# Altium schematic sheet cpu.SchDoc
size A4
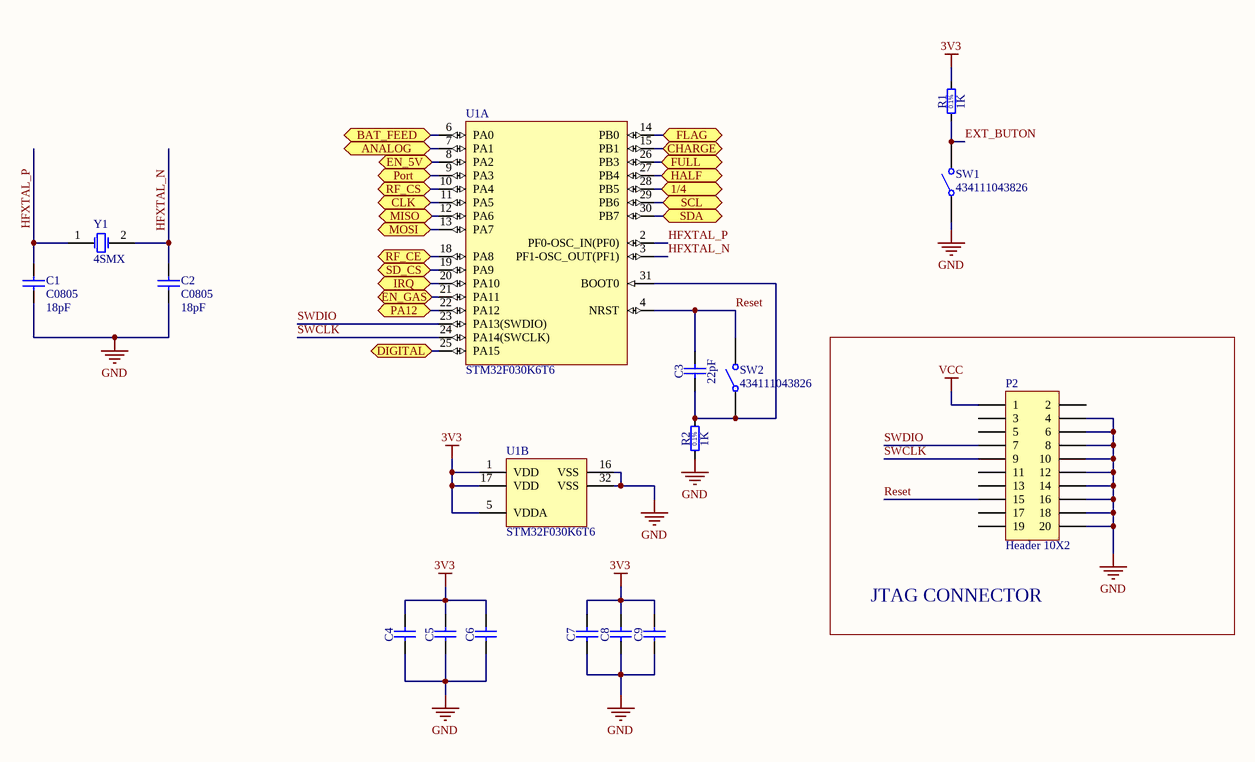
[diagram p0: cpu.SchDoc]

## Parts
C1  C0805  value 18pF  [0805]
C2  C0805  value 18pF  [0805]
C3  22pF  [CAPC2012X135N]
C4  100nF  [CAPC2012X135N]  (value not drawn)
C5  100nF  [CAPC2012X135N]  (value not drawn)
C6  100nF  [CAPC2012X135N]  (value not drawn)
C7  100nF  [CAPC2012X135N]  (value not drawn)
C8  100nF  [CAPC2012X135N]  (value not drawn)
C9  100nF  [CAPC2012X135N]  (value not drawn)
P2  Header 10X2  [HDR2X10]
R1  1K  [RESC2012X60N]
R2  1K  [RESC2012X60N]
SW1  434111043826  [434111043826]
SW2  434111043826  [434111043826]
U1  STM32F030K6T6  [STM-LQFP32_N]  (parts A,B of 2)
Y1  4SMX  [4SMX]

## Blocks framed on the sheet
JTAG CONNECTOR: P2

## Ports
1/4, ANALOG, BAT_FEED, CHARGE, CLK, DIGITAL, EN_5V, EN_GAS, FLAG, FULL, HALF, IRQ, MISO, MOSI, PA12, Port, RF_CE, RF_CS, SCL, SD_CS, SDA

## Nets
3V3: C4.2 C5.2 C6.2 C7.2 C8.2 C9.2 R1.2 U1.1(VDD) U1.5(VDDA) U1.17(VDD)
GND: C1.1 C2.1 C4.1 C5.1 C6.1 C7.1 C8.1 C9.1 P2.4 P2.6 P2.8 P2.10 P2.12 P2.14 P2.16 P2.18 P2.20 R2.1 SW1.1 U1.16(VSS) U1.32(VSS)
VCC: P2.1
1/4: U1.28(PB5) ; port 1/4
ANALOG: U1.7(PA1) ; port ANALOG
BAT_FEED: U1.6(PA0) ; port BAT_FEED
CHARGE: U1.15(PB1) ; port CHARGE
CLK: U1.11(PA5) ; port CLK
DIGITAL: U1.25(PA15) ; port DIGITAL
EN_5V: U1.8(PA2) ; port EN_5V
EN_GAS: U1.21(PA11) ; port EN_GAS
EXT_BUTON: R1.1 SW1.2
FLAG: U1.14(PB0) ; port FLAG
FULL: U1.26(PB3) ; port FULL
HALF: U1.27(PB4) ; port HALF
HFXTAL_N: C2.2 U1.3(PF1-OSC_OUT(PF1)) Y1.2(OSC2)
HFXTAL_P: C1.2 U1.2(PF0-OSC_IN(PF0)) Y1.1(OSC1)
IRQ: U1.20(PA10) ; port IRQ
MISO: U1.12(PA6) ; port MISO
MOSI: U1.13(PA7) ; port MOSI
PA12: U1.22(PA12) ; port PA12
Port: U1.9(PA3) ; port Port
Reset: C3.2 P2.15 SW2.2 U1.4(NRST)
RF_CE: U1.18(PA8) ; port RF_CE
RF_CS: U1.10(PA4) ; port RF_CS
SCL: U1.29(PB6) ; port SCL
SD_CS: U1.19(PA9) ; port SD_CS
SDA: U1.30(PB7) ; port SDA
SWCLK: P2.9 U1.24(PA14(SWCLK))
SWDIO: P2.7 U1.23(PA13(SWDIO))
NetC3_1: C3.1 R2.2 SW2.1 U1.31(BOOT0)

Not connected (* = marked no-connect by the designer): P2 2 3 5 11 13 17 19

## Notes on the sheet
- (in symbol R0805_1K1_0.1%_0.1W_10PPM) 0.1%

## Library data of the parts
C1 C2 = C0805: Ceramic Chip Capacitor - Standard; Note: Footprint corresponds to dimensions for bulk cassette packaging. This case size has tightened tolerances.; Published: 17-Jul-2002; LatestRevisionDate: 19-Mar-2004; LatestRevisionNote: Silkscreen size reduced.; DatasheetDocument: Mar-2001; PackageDocument: Mar-2001; PackageReference: 0805; Publisher: Altium Limited; Code_JEITA: 0805; Code_IPC: 2012[0805]; ComponentLink1Description: Manufacturer Link; ComponentLink1URL: http://www.kemet.com/; ComponentLink2Description: Datasheet; ComponentLink2URL: http://www.kemet.com/kemet/web/homepage/kechome.nsf/vapubfilesname/F3102TA.pdf/$file/F3102TA.pdf
C3 = CC0805_10NF_50V_10%_X7R: Non-polarised capacitor; Part Description: SMD Multilayer Chip Ceramic Capacitor; Manufacturer: GENERIC; Manufacturer1 Part Number: B37941K5103K60; Voltage: 50V; TC: X7R; Tolerance: ±10%; Table: Capacitors SMD; Part Number: CC0805_10NF_50V_10%_X7R; Component Kind: Standard; Component Type: Standard; Pin Count: 2; Value: 22pF; Status: Preferred; Manufacturer Part Number: CC0805_10NF_50V_10%_X7R; Case: 0805; Mounted: Yes; Socket: No; SMD: Yes; Manufacturer1 Example: EPCOS; Manufacturer1 ComponentHeight: 1.35mm; HelpURL: \\cern.ch\dfs\Applications\Altium\Datasheets\CC0805_X7R_EPCOS.pdf; Author: CERN DEM JLC; CreateDate: 03.12.2007; LatestRevisionDate: 03.12.2007
C4-C9 = CC0805_1NF_50V_5%_X7R: Non-polarised capacitor; Part Description: SMD Multilayer Chip Ceramic Capacitor; Manufacturer: GENERIC; Manufacturer1 Part Number: 08055C102JAT2A; Voltage: 50V; TC: X7R; Tolerance: ±5%; Table: Capacitors SMD; Part Number: CC0805_1NF_50V_5%_X7R; Component Kind: Standard; Component Type: Standard; Pin Count: 2; Value: 100nF; Status: None; Manufacturer Part Number: CC0805_1NF_50V_5%_X7R; Case: 0805; Mounted: Yes; Socket: No; SMD: Yes; Manufacturer1 Example: AVX; Manufacturer1 ComponentHeight: 0.94mm; HelpURL: \\cern.ch\dfs\Applications\Altium\Datasheets\CC0805_X7R_AVX.pdf; Author: CERN DEM JLC; CreateDate: 18.01.2011; LatestRevisionDate: 18.01.2011
P2 = Header 10X2: Header, 10-Pin, Dual row; LatestRevisionDate: 17-Jul-2002; LatestRevisionNote: Re-released for DXP Platform.; Publisher: Altium Limited
R1 R2 = R0805_1K1_0.1%_0.1W_10PPM: Resistor - 0.1%; Part Description: Thin Film Chip Resistor; Manufacturer: GENERIC; Manufacturer1 Part Number: RN73C2A1K1BTG; Power: 0.1W; TC: ±10ppm; Table: Resistors SMD; Part Number: R0805_1K1_0.1%_0.1W_10PPM; Component Kind: Standard; Component Type: Standard; Pin Count: 2; Value: 1K; Status: Not recommended; Tolerance: ±0.1%; Manufacturer Part Number: R0805_1K1_0.1%_0.1W_10PPM; Case: 0805; Mounted: Yes; Socket: No; SMD: Yes; Manufacturer1 Example: TYCO HOLSWORTHY; Manufacturer1 ComponentHeight: 0.6mm; HelpURL: \\cern.ch\dfs\Applications\Altium\Datasheets\R0805_Tyco_RN73.pdf; Author: CERN DEM JLC; CreateDate: 03.12.2007; LatestRevisionDate: 13.03.2008
SW1 SW2 = 434111043826: WS-TASV SMD Tact Switch 6.0X3.5 mm; NoPins: 02; PackageReference: 434111043826; PartNumber: 434111043826; ComponentLink1Description: Manufacturer URL; ComponentLink1URL: http://www.we-online.com; ComponentLink2Description: Datasheet; ComponentLink2URL: http://katalog.we-online.de/em/datasheet/434111043826.pdf
U1 = STM32F030K6T6: ARM Cortex-M0 32-bit MCU, 32 KB Flash, 4 KB Internal RAM, 26 I/Os, 32-pin LQFP, -40 to 85 degC, Tray; FLASH Size (Prog) (kB): 32; I/Os (High Current): 26; Internal RAM Size (kB): 4; Operating Frequency(F) (Processor speed) (MHz): 48; Supply Voltage(Vcc) min (V): 2.4; DatasheetVersion: Rev. 1; PackageVersion: Rev. 1, 07/2013; PackageReference: LQFP32; PackageDescription: 32-Pin Low Profile Quad Flat Package, 7 x 7 mm Body, 0.8 mm Pitch; Supplier 1: Digi-Key; Supplier Part Number 1: 497-14046-ND; Supplier 2: Newark; Supplier Part Number 2: 19X6194; Supplier 3: Mouser; Supplier Part Number 3: 511-STM32F030K6T6; Core: ARM Cortex-M0; Packing: Tray; Mounting Technology: Surface Mount; PartNumber: STM32F030K6T6; ComponentLink1Description: Manufacturer URL; ComponentLink1URL: http://www.st.com/web/en/home.html; ComponentLink2Description: Datasheet; ComponentLink2URL: http://www.st.com/st-web-ui/static/active/en/resource/technical/document/datasheet/DM00088500.pdf; ComponentLink3Description: Package Specification; ComponentLink3URL: http://www.st.com/st-web-ui/static/active/en/resource/technical/document/datasheet/DM00088500.pdf
Y1 = 4SMX: Surface Mount Quartz Crystal; Note: PCB layout complies with manufacturer's recommendation.; Published: 17-Jul-2002; DatasheetDocument: 9-Sep-1999; PackageDocument: 9-Sep-1999; PackageReference: 4SMX; Publisher: Altium Limited; ComponentLink1Description: Manufacturer Link; ComponentLink1URL: http://www.cmac.com/mt/